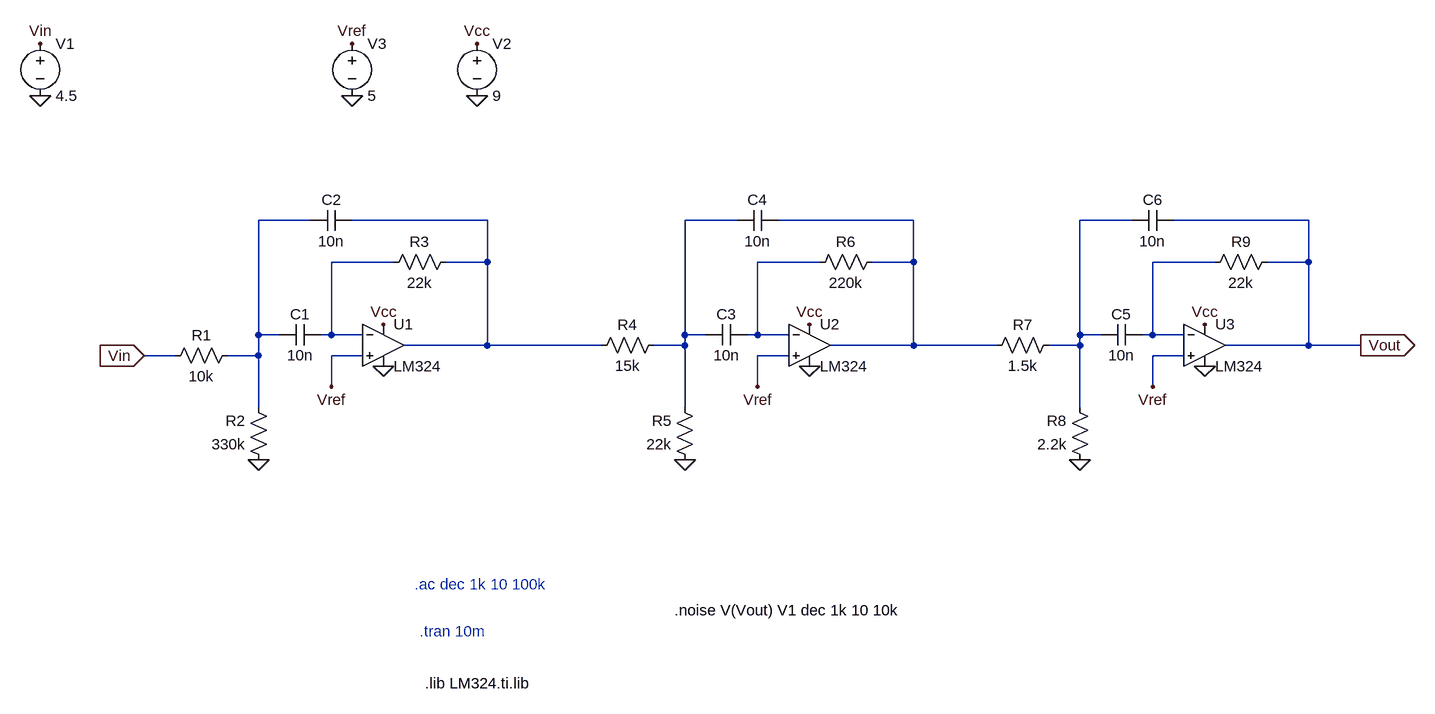
[diagram p0: schematic Draft3.asc]
Draft3.asc, the LTspice schematic file:
Version 4
SHEET 1 1648 1168
WIRE -80 128 -160 128
WIRE 192 128 -16 128
WIRE 576 128 496 128
WIRE 848 128 640 128
WIRE 1184 128 1104 128
WIRE 1456 128 1248 128
WIRE 48 192 -48 192
WIRE 192 192 192 128
WIRE 192 192 128 192
WIRE 704 192 608 192
WIRE 848 192 848 128
WIRE 848 192 784 192
WIRE 1312 192 1216 192
WIRE 1456 192 1456 128
WIRE 1456 192 1392 192
WIRE -160 304 -160 128
WIRE -128 304 -160 304
WIRE -48 304 -48 192
WIRE -48 304 -64 304
WIRE 0 304 -48 304
WIRE 496 304 496 128
WIRE 528 304 496 304
WIRE 608 304 608 192
WIRE 608 304 592 304
WIRE 656 304 608 304
WIRE 1104 304 1104 128
WIRE 1136 304 1104 304
WIRE 1216 304 1216 192
WIRE 1216 304 1200 304
WIRE 1264 304 1216 304
WIRE 192 320 192 192
WIRE 192 320 64 320
WIRE 368 320 192 320
WIRE 496 320 496 304
WIRE 496 320 448 320
WIRE 848 320 848 192
WIRE 848 320 720 320
WIRE 976 320 848 320
WIRE 1104 320 1104 304
WIRE 1104 320 1056 320
WIRE 1456 320 1456 192
WIRE 1456 320 1328 320
WIRE 1536 320 1456 320
WIRE -288 336 -336 336
WIRE -160 336 -160 304
WIRE -160 336 -208 336
WIRE 0 336 -48 336
WIRE 656 336 608 336
WIRE 1264 336 1216 336
WIRE -48 384 -48 336
WIRE 608 384 608 336
WIRE 1216 384 1216 336
WIRE -160 416 -160 336
WIRE 496 416 496 320
WIRE 1104 416 1104 320
FLAG 32 288 Vcc
FLAG 32 352 0
FLAG 688 288 Vcc
FLAG 688 352 0
FLAG 1296 288 Vcc
FLAG 1296 352 0
FLAG 1536 320 Vout
IOPIN 1536 320 Out
FLAG 1104 496 0
FLAG 496 496 0
FLAG -160 496 0
FLAG -48 384 Vref
FLAG 608 384 Vref
FLAG 1216 384 Vref
FLAG -496 -64 0
FLAG 176 -64 0
FLAG 176 -144 Vcc
FLAG -16 -64 0
FLAG -16 -144 Vref
FLAG -496 -144 Vin
FLAG -336 336 Vin
IOPIN -336 336 In
SYMBOL res -192 320 R90
WINDOW 0 0 56 VBottom 2
WINDOW 3 32 56 VTop 2
SYMATTR InstName R1
SYMATTR Value 10k
SYMBOL res -144 512 R180
WINDOW 0 36 76 Left 2
WINDOW 3 36 40 Left 2
SYMATTR InstName R2
SYMATTR Value 330k
SYMBOL cap -64 288 R90
WINDOW 0 0 32 VBottom 2
WINDOW 3 32 32 VTop 2
SYMATTR InstName C1
SYMATTR Value 10n
SYMBOL res 144 176 R90
WINDOW 0 0 56 VBottom 2
WINDOW 3 32 56 VTop 2
SYMATTR InstName R3
SYMATTR Value 22k
SYMBOL cap -16 112 R90
WINDOW 0 0 32 VBottom 2
WINDOW 3 32 32 VTop 2
SYMATTR InstName C2
SYMATTR Value 10n
SYMBOL res 464 304 R90
WINDOW 0 0 56 VBottom 2
WINDOW 3 32 56 VTop 2
SYMATTR InstName R4
SYMATTR Value 15k
SYMBOL res 512 512 R180
WINDOW 0 36 76 Left 2
WINDOW 3 36 40 Left 2
SYMATTR InstName R5
SYMATTR Value 22k
SYMBOL cap 592 288 R90
WINDOW 0 0 32 VBottom 2
WINDOW 3 32 32 VTop 2
SYMATTR InstName C3
SYMATTR Value 10n
SYMBOL res 800 176 R90
WINDOW 0 0 56 VBottom 2
WINDOW 3 32 56 VTop 2
SYMATTR InstName R6
SYMATTR Value 220k
SYMBOL cap 640 112 R90
WINDOW 0 0 32 VBottom 2
WINDOW 3 32 32 VTop 2
SYMATTR InstName C4
SYMATTR Value 10n
SYMBOL res 1072 304 R90
WINDOW 0 0 56 VBottom 2
WINDOW 3 32 56 VTop 2
SYMATTR InstName R7
SYMATTR Value 1.5k
SYMBOL res 1120 512 R180
WINDOW 0 36 76 Left 2
WINDOW 3 36 40 Left 2
SYMATTR InstName R8
SYMATTR Value 2.2k
SYMBOL cap 1200 288 R90
WINDOW 0 0 32 VBottom 2
WINDOW 3 32 32 VTop 2
SYMATTR InstName C5
SYMATTR Value 10n
SYMBOL res 1408 176 R90
WINDOW 0 0 56 VBottom 2
WINDOW 3 32 56 VTop 2
SYMATTR InstName R9
SYMATTR Value 22k
SYMBOL cap 1248 112 R90
WINDOW 0 0 32 VBottom 2
WINDOW 3 32 32 VTop 2
SYMATTR InstName C6
SYMATTR Value 10n
SYMBOL opamp2 32 256 R0
SYMATTR InstName U1
SYMATTR Value LM324
SYMBOL opamp2 688 256 R0
SYMATTR InstName U2
SYMATTR Value LM324
SYMBOL opamp2 1296 256 R0
SYMATTR InstName U3
SYMATTR Value LM324
SYMBOL Voltage -496 -160 R0
SYMATTR InstName V1
SYMATTR Value 4.5
SYMATTR Value2 AC 1 0
SYMBOL voltage 176 -160 R0
WINDOW 123 0 0 Left 0
WINDOW 39 0 0 Left 0
SYMATTR InstName V2
SYMATTR Value 9
SYMBOL Voltage -16 -160 R0
SYMATTR InstName V3
SYMATTR Value 5
TEXT 80 688 Left 2 ;.ac dec 1k 10 100k
TEXT 88 760 Left 2 ;.tran 10m
TEXT 96 840 Left 2 !.lib LM324.ti.lib
TEXT 480 728 Left 2 !.noise V(Vout) V1 dec 1k 10 10k

The netlist it stands for:
* Draft3.asc
R1 N001 Vin 10k
R2 0 N001 330k
C1 N006 N001 10n
R3 N002 N006 22k
C2 N002 N001 10n
R4 N003 N002 15k
R5 0 N003 22k
C3 N007 N003 10n
R6 N004 N007 220k
C4 N004 N003 10n
R7 N005 N004 1.5k
R8 0 N005 2.2k
C5 N008 N005 10n
R9 Vout N008 22k
C6 Vout N005 10n
XU1 Vref N006 Vcc 0 N002 LM324  ; pins In+ In- V+ V- OUT
XU2 Vref N007 Vcc 0 N004 LM324  ; pins In+ In- V+ V- OUT
XU3 Vref N008 Vcc 0 Vout LM324  ; pins In+ In- V+ V- OUT
V1 Vin 0 4.5 AC 1 0
V2 Vcc 0 9
V3 Vref 0 5
* .ac dec 1k 10 100k
* .tran 10m
.lib LM324.ti.lib
.noise V(Vout) V1 dec 1k 10 10k
.backanno
.end